# EAGLE design top.bpcb (EAGLE 5.04)
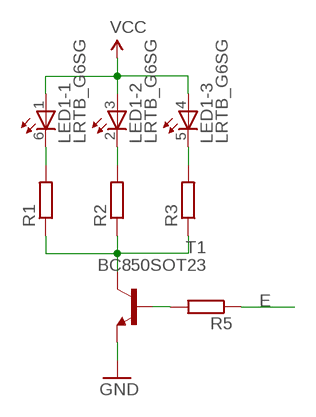
[diagram p0: schematic, sheet 1]

## Parts
LED1  LRTB_G6SG  [LRTB_G6SG]
R1  R-EU_R0603  [R0603]
R2  R-EU_R0603  [R0603]
R3  R-EU_R0603  [R0603]
R5  R-EU_R0603  [R0603]
T1  BC850SOT23  [SOT23]

## Nets
E: R5.1
GND: T1.2(E)
N$2: R5.2 T1.1(B)
N$3: LED1.6(-1:C) R1.2
N$4: LED1.2(-2:C) R2.2
N$5: LED1.5(-3:C) R3.2
S: R1.1 R2.1 R3.1 T1.3(C)
VCC: LED1.1(-1:A) LED1.3(-2:A) LED1.4(-3:A)

## Library data of the parts
LED1 = led:LRTB_G6SG: LRTB G6SG 6-lead TOPLED® Source: OSRAM Opto Semiconductors ... LRTB_G6SG_Pb_free.pdf
R1-R3 R5 = resistor:R-EU_: RESISTOR, European symbol
T1 = additional:BC850: NPN TRANSISTOR

## Board
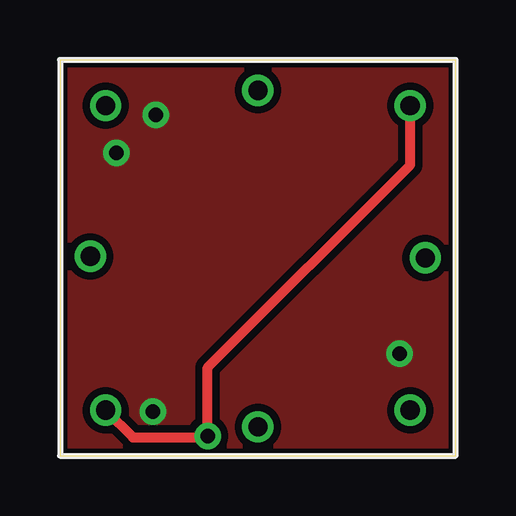
[diagram p1: board, top side]
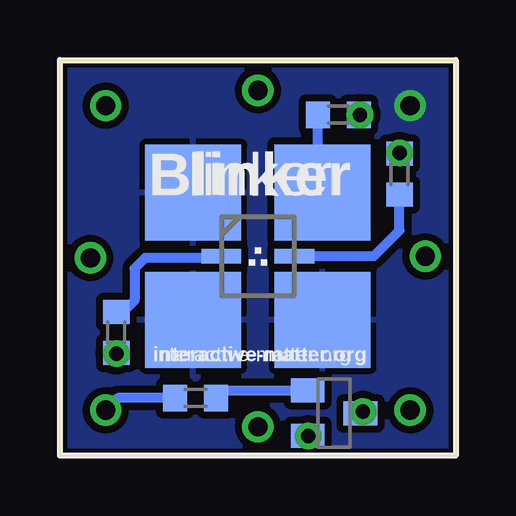
[diagram p2: board, bottom side, seen from below]

Size 16.51 x 16.51 mm. Coordinates in mm from the lower left corner, seen from the top.
Outline: 16.51,0 16.51,16.51 0,16.51 0,0 16.51,0
Copper layers (1*16): Top 0.035mm / dielectric 1.5mm / Bottom 0.035mm
Design rules "SparkFun": minimum track width 8mil, minimum drill 20mil, track to track 8mil, track to pad 8mil, pad to pad 8mil, via to via 8mil, smd to smd 0mil, copper to edge 10mil, drill to drill 8mil, minimum pad ring 12mil, minimum via ring 10mil, stop-mask expansion 4mil, vias tented up to drill 25mil, thermal gap 10mil

### Footprints (pad centres in the part's own frame; a part is rotated, then mirrored left to right if it is on the bottom)
LRTB_G6SG = smd 4 x 4: 1 -2.65,-2.7; 3 2.65,-2.7; 4 2.65,2.7; 6 -2.65,2.7 | smd 0.6 x 1.65: 2 0,-1.525; 5 0,1.525
R0603 = smd 1 x 1.1: 1 -0.85,0; 2 0.85,0
SOT23 = smd 1 x 1.4: 1 -0.95,-1.1; 2 0.95,-1.1; 3 0,1.1

### Placement (x,y rotation side)
LED1  8.26,8.32 270 bottom
R1  4.89,14.22 180 bottom
R2  14.16,5.14 90 bottom
R3  2.35,11.75 270 bottom
R5  10.86,2.41 0 bottom
T1  5.08,1.78 270 bottom

### Tracks (layer width: path | path; a pad name or v marks a point on that pad's centre or on a via)
E  (via drill 0.8)
  Bottom 0.406: R5.1 14.1,2.41 v14.61,1.91
GND  (via drill 0.6, 0.8)
  Top 0.406: v14.61,14.61 14.61,12.13 6.16,3.68 6.16,1.27 5.94,1.05 | v1.91,1.91 3.05,0.76 5.71,0.76 5.94,1.05 | v6.16,0.83 5.84,0.83 5.94,1.05
  Bottom 0.406: 6.23,0.89 6.22,0.89 | 6.23,0.89 T1.2 | 6.23,0.89 6.35,0.89 v6.16,0.83
N$2
  Bottom 0.406: R5.2 9.76,2.73 T1.1
N$3
  Bottom 0.406: R1.2 5.74,11.15 LED1.6
N$4
  Bottom 0.406: LED1.2 9.84,8.26 12.95,8.26 13.4,7.81 13.4,6.48 13.88,5.99 R2.2
N$5
  Bottom 0.406: LED1.5 3.43,8.32 2.35,9.4 R3.2
N$6  (via drill 0.8)
  other vias: 8.26,1.21
N$7  (via drill 0.8)
  other vias: 1.27,8.32
N$9  (via drill 0.8)
  other vias: 8.26,15.24
N$10  (via drill 0.8)
  other vias: 15.24,8.26
S  (via drill 0.6)
  Bottom 0.406: T1.3 v3.87,1.84 | R3.1 v2.35,12.64 | R1.1 v4,14.22 | R2.1 v14.16,4.25
  pour Top (isolate 0.305): -0.19,-0.25 -0.19,16.76 16.7,16.76 16.7,-0.19
VCC  (via drill 0.8)
  other vias: 1.91,14.61
  pour Bottom (isolate 0.305): -0.32,-0.32 -0.32,16.83 16.76,16.83 16.76,-0.19

### Text on the board
bNames: Blinker | interactive-matter.org
_bsilk: Blinker | interactive-matter.org